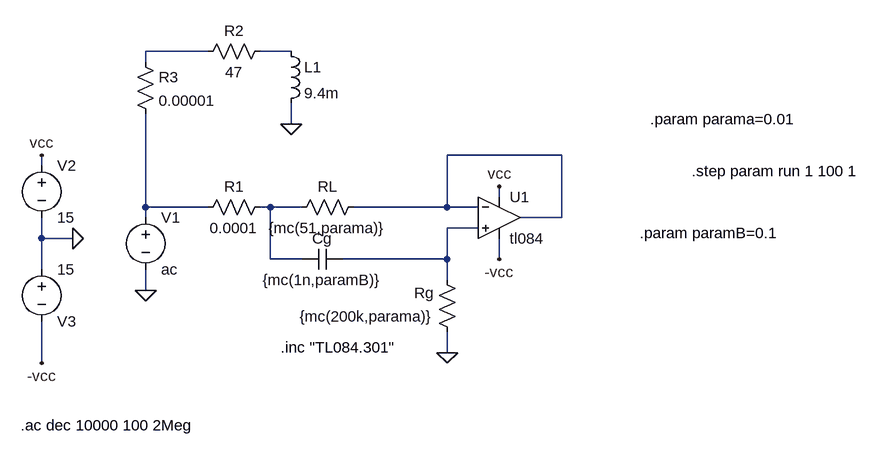
[diagram p0: schematic gyrator.asc]
gyrator.asc, the LTspice schematic file:
Version 4
SHEET 1 1092 680
WIRE 80 -144 -16 -144
WIRE 208 -144 160 -144
WIRE -16 -128 -16 -144
WIRE 208 -32 208 -64
WIRE 624 16 448 16
WIRE -176 32 -176 16
WIRE 528 80 528 64
WIRE -16 96 -16 -48
WIRE 80 96 -16 96
WIRE 176 96 160 96
WIRE 224 96 176 96
WIRE 448 96 448 16
WIRE 448 96 304 96
WIRE 496 96 448 96
WIRE -16 112 -16 96
WIRE 624 112 624 16
WIRE 624 112 560 112
WIRE 496 128 448 128
WIRE -176 144 -176 112
WIRE -128 144 -176 144
WIRE 176 176 176 96
WIRE 224 176 176 176
WIRE 448 176 448 128
WIRE 448 176 288 176
WIRE 528 176 528 144
WIRE -176 192 -176 144
WIRE 448 208 448 176
WIRE -16 224 -16 192
WIRE 448 320 448 288
WIRE -176 336 -176 272
FLAG -128 144 0
FLAG -176 16 vcc
FLAG -176 336 -vcc
FLAG 528 64 vcc
FLAG 528 176 -vcc
FLAG 448 320 0
FLAG -16 224 0
FLAG 208 -32 0
SYMBOL res 320 80 R90
WINDOW 0 0 56 VBottom 2
WINDOW 3 32 56 VTop 2
SYMATTR InstName RL
SYMATTR Value {mc(51,parama)}
SYMBOL res 464 304 R180
WINDOW 0 36 76 Left 2
WINDOW 3 36 40 Left 2
SYMATTR InstName Rg
SYMATTR Value {mc(200k,parama)}
SYMBOL cap 288 160 R90
WINDOW 0 0 32 VBottom 2
WINDOW 3 32 32 VTop 2
SYMATTR InstName Cg
SYMATTR Value {mc(1n,paramB)}
SYMBOL Opamps\\opamp2 528 48 R0
SYMATTR InstName U1
SYMATTR Value tl084
SYMBOL voltage -16 96 R0
WINDOW 123 0 0 Left 0
WINDOW 39 0 0 Left 0
SYMATTR InstName V1
SYMATTR Value ac
SYMBOL voltage -176 16 R0
WINDOW 123 0 0 Left 0
WINDOW 39 0 0 Left 0
SYMATTR InstName V2
SYMATTR Value 15
SYMBOL voltage -176 176 R0
WINDOW 0 24 96 Left 2
WINDOW 3 24 16 Left 2
WINDOW 123 0 0 Left 0
WINDOW 39 0 0 Left 0
SYMATTR InstName V3
SYMATTR Value 15
SYMBOL res 176 80 R90
WINDOW 0 0 56 VBottom 2
WINDOW 3 32 56 VTop 2
SYMATTR InstName R1
SYMATTR Value 0.0001
SYMBOL res 176 -160 R90
WINDOW 0 0 56 VBottom 2
WINDOW 3 32 56 VTop 2
SYMATTR InstName R2
SYMATTR Value 47
SYMBOL ind 192 -160 R0
SYMATTR InstName L1
SYMATTR Value 9.4m
SYMBOL res -32 -144 R0
SYMATTR InstName R3
SYMATTR Value 0.00001
TEXT 192 312 Left 2 !.inc "TL084.301"
TEXT -208 432 Left 2 !.ac dec 10000 100 2Meg
TEXT 760 -40 Left 2 !.param parama=0.01
TEXT 744 136 Left 2 !.param paramB=0.1
TEXT 824 40 Left 2 !.step param run 1 100 1

The netlist it stands for:
* gyrator.asc
RL N003 N005 {mc(51,parama)}
Rg 0 N006 {mc(200k,parama)}
Cg N006 N005 {mc(1n,paramB)}
XU1 N006 N003 vcc -vcc N003 tl084  ; pins In+ In- V+ V- OUT
V1 N004 0 ac
V2 vcc 0 15
V3 0 -vcc 15
R1 N005 N004 0.0001
R2 N002 N001 47
L1 N002 0 9.4m
R3 N001 N004 0.00001
.inc "TL084.301"
.ac dec 10000 100 2Meg
.param parama=0.01
.param paramB=0.1
.step param run 1 100 1
.backanno
.end